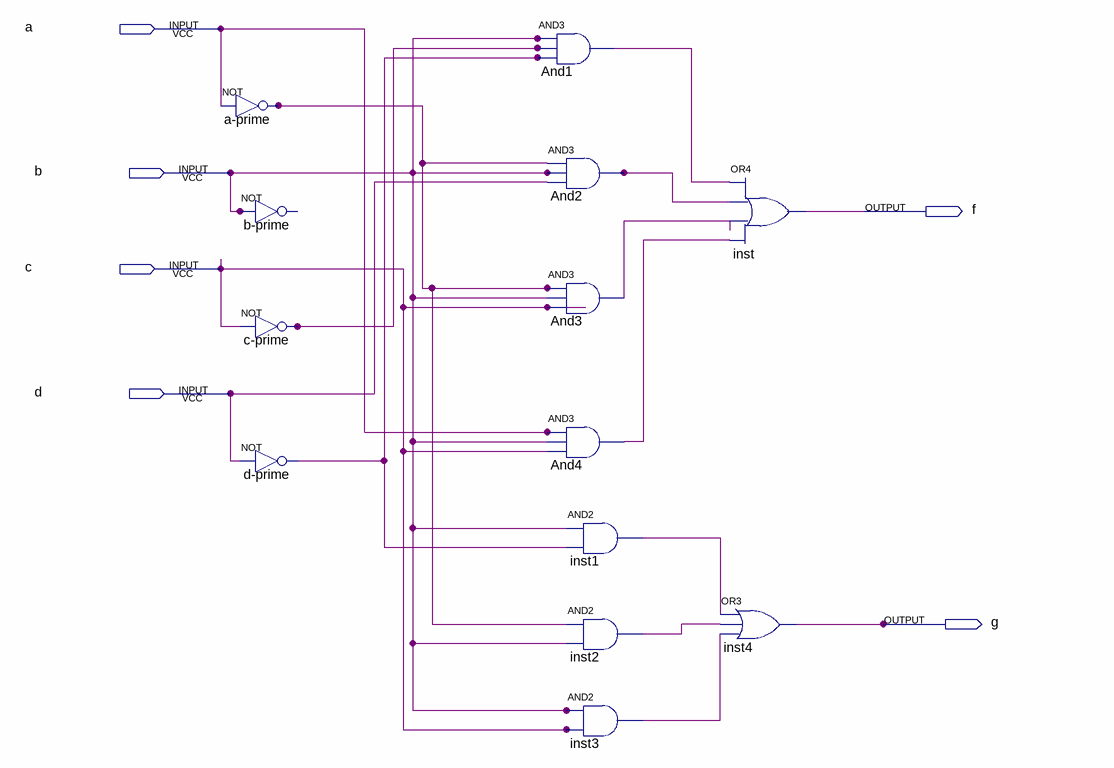
[diagram p0: schematic sheet]
// Quartus schematic Lab1.bdf as structural Verilog: 13 symbols, 6 pins
module Lab1 (
  input  a,
  input  b,
  input  c,
  input  d,
  output f,
  output g
);

  wire a_prime_out, And1_out, And2_out, And3_out, And4_out, c_prime_out, d_prime_out, inst1_out, inst2_out,
       inst3_out;

  not \a-prime  (a_prime_out, a);
  // NOT b-prime has open pins: IN=b, OUT=open
  not \c-prime  (c_prime_out, c);
  not \d-prime  (d_prime_out, d);
  and And1 (And1_out, b, c_prime_out, d_prime_out);
  and And2 (And2_out, a_prime_out, b, d);
  and And3 (And3_out, a_prime_out, b, c);
  and And4 (And4_out, a, b, c);
  and inst1 (inst1_out, b, d_prime_out);
  and inst2 (inst2_out, a_prime_out, b);
  and inst3 (inst3_out, b, c);
  or inst (f, And1_out, And2_out, And3_out, And4_out);
  or inst4 (g, inst1_out, inst2_out, inst3_out);
endmodule
